# Altium project cutom_line_V1.PrjPCB
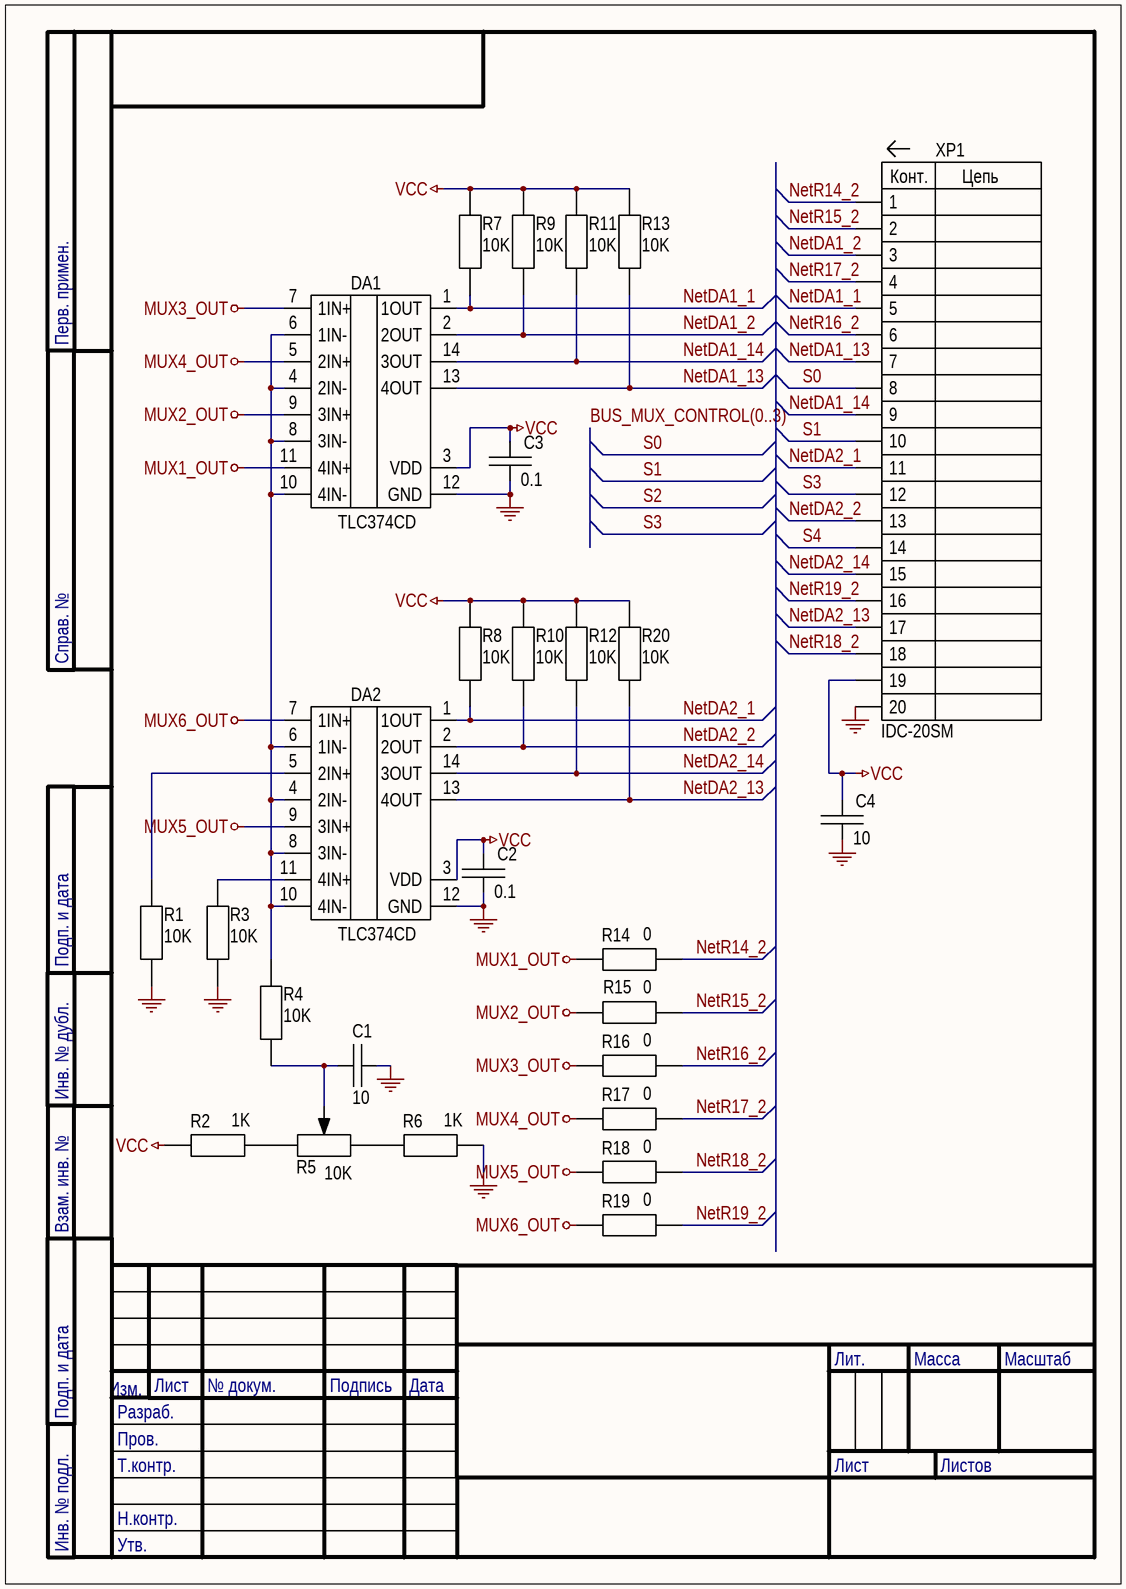
[diagram p0: custom_line_V1_comp.SchDoc]
8 sheets, 243 parts. Net scope: global (net labels, ports and power ports of the same name join across sheets).
Board file: custom_line_V1.PcbDoc
Sheets:
  custom_line_V1_comp.SchDoc
  custom_line_V1_mux1.SchDoc
  custom_line_V1_mux2.SchDoc
  custom_line_V1_mux3.SchDoc
  custom_line_V1_mux4.SchDoc
  custom_line_V1_mux5.SchDoc
  custom_line_V1_mux6.SchDoc
  Connection_To_STM32F3DYSCOVERY.SchDoc

## Sheet custom_line_V1_comp.SchDoc
size 209 x 297 mm

### Parts
C1  10  [CC_0805]
C2  0.1  [CC_0603]
C3  0.1  [CC_0603]
C4  10  [CC_0805]
DA1  type: TLC374CD  [SOIC-14]  (hidden comment: TLC374)
DA2  type: TLC374CD  [SOIC-14]  (hidden comment: TLC374)
R1  10K  [RC_0603_SMALL]
R2  1K  [RC_0603_SMALL]
R3  10K  [RC_0603_SMALL]
R4  10K  [RC_0603_SMALL]
R5  10K  [Res_3266W]
R6  1K  [RC_0603_SMALL]
R7  10K  [RC_0603_SMALL]
R8  10K  [RC_0603_SMALL]
R9  10K  [RC_0603_SMALL]
R10  10K  [RC_0603_SMALL]
R11  10K  [RC_0603_SMALL]
R12  10K  [RC_0603_SMALL]
R13  10K  [RC_0603_SMALL]
R14  0  [RC_0603_SMALL]
R15  0  [RC_0603_SMALL]
R16  0  [RC_0603_SMALL]
R17  0  [RC_0603_SMALL]
R18  0  [RC_0603_SMALL]
R19  0  [RC_0603_SMALL]
R20  10K  [RC_0603_SMALL]
XP1  IDC-20SM  [IDC-20SM]

### Nets
GND: C1.1 C2.1 C3.1 C4.1 DA1.12(GND) DA2.12(GND) R1.2 R3.2 R6.2 XP1.20
MUX1_OUT: DA1.11(4IN+) R14.1
MUX2_OUT: DA1.9(3IN+) R15.1
MUX3_OUT: DA1.7(1IN+) R16.1
MUX4_OUT: DA1.5(2IN+) R17.1
MUX5_OUT: DA2.9(3IN+) R18.1
MUX6_OUT: DA2.7(1IN+) R19.1
VCC: C2.2 C3.2 C4.2 DA1.3(VDD) DA2.3(VDD) R2.1 R7.1 R8.1 R9.1 R10.1 R11.1 R12.1 R13.1 R20.1 XP1.19
NetDA1_1: DA1.1(1OUT) R7.2 XP1.5
NetDA1_2: DA1.2(2OUT) R9.2 XP1.3
NetDA1_13: DA1.13(4OUT) R13.2 XP1.7
NetDA1_14: DA1.14(3OUT) R11.2 XP1.9
NetDA2_1: DA2.1(1OUT) R8.2 XP1.11
NetDA2_2: DA2.2(2OUT) R10.2 XP1.13
NetDA2_13: DA2.13(4OUT) R20.2 XP1.17
NetDA2_14: DA2.14(3OUT) R12.2 XP1.15
NetR14_2: R14.2 XP1.1
NetR15_2: R15.2 XP1.2
NetR16_2: R16.2 XP1.6
NetR17_2: R17.2 XP1.4
NetR18_2: R18.2 XP1.18
NetR19_2: R19.2 XP1.16
S0: XP1.8
S1: XP1.10
S3: XP1.12
S4: XP1.14
NetC1_2: C1.2 R4.2 R5.2
NetDA1_4: DA1.4(2IN-) DA1.6(1IN-) DA1.8(3IN-) DA1.10(4IN-) DA2.4(2IN-) DA2.6(1IN-) DA2.8(3IN-) DA2.10(4IN-) R4.1
NetDA2_5: DA2.5(2IN+) R1.1
NetDA2_11: DA2.11(4IN+) R3.1
NetR2_2: R2.2 R5.1
NetR5_3: R5.3 R6.1

### Buses and harness runs
bus BUS_MUX_CONTROL(0..3)

### Notes on the sheet
- Перв. примен.
- Справ. №
- Подп. и дата
- Инв. № дубл.
- Взам. инв. №
- Изм.
- Лист
- № докум.
- Подпись
- Дата
- Лит.
- Масса
- Масштаб
- Разраб.
- Пров.
- Т.контр.
- Листов
- Н.контр.
- Инв. № подл.
- Утв.
- (in symbol XT_IDC-20SM) Конт.; Цепь

### Library data of the parts
C1 C4 = C: SMD Cap 0805,106, 16V, X5R, 10% (YAGEO); type: CC0805KKX7R7BB106; value: 10uF
C2 C3 = C: SMD Cap 0603, 104, 16V, X7R, 10% (YAGEO); type: CC0603KRX7R7BB104; value: 0.1uF
DA1 DA2 = TLC374: Four Comparators (Texas Instruments)
R1 R3 R4 R7-R13 R20 = R: SMD Res 0603, 10 kOh, 1% (YAGEO); power: 0.125W; type: AC0603FR-0710KL; value: 10K
R2 R6 = R: SMD Res 0603, 1 kOh, 1% (YAGEO); power: 0.125W; type: AC0603FR-071KL; value: 1K
R5 = R_potentiometer: Trimming Potentiometer 3266W (Bourns); Tupe: 3266W-1-103LF; power: 0.25W; value: 10K
R14-R19 = R: power: 0.125W; type: RC-0603-000-5%; value: 0
XP1 = XT_IDC-20SM: Connector IDC-20SM (Connfly); type: DS1013-20SSIB1-B-0

## Sheet custom_line_V1_mux1.SchDoc
size 209 x 297 mm
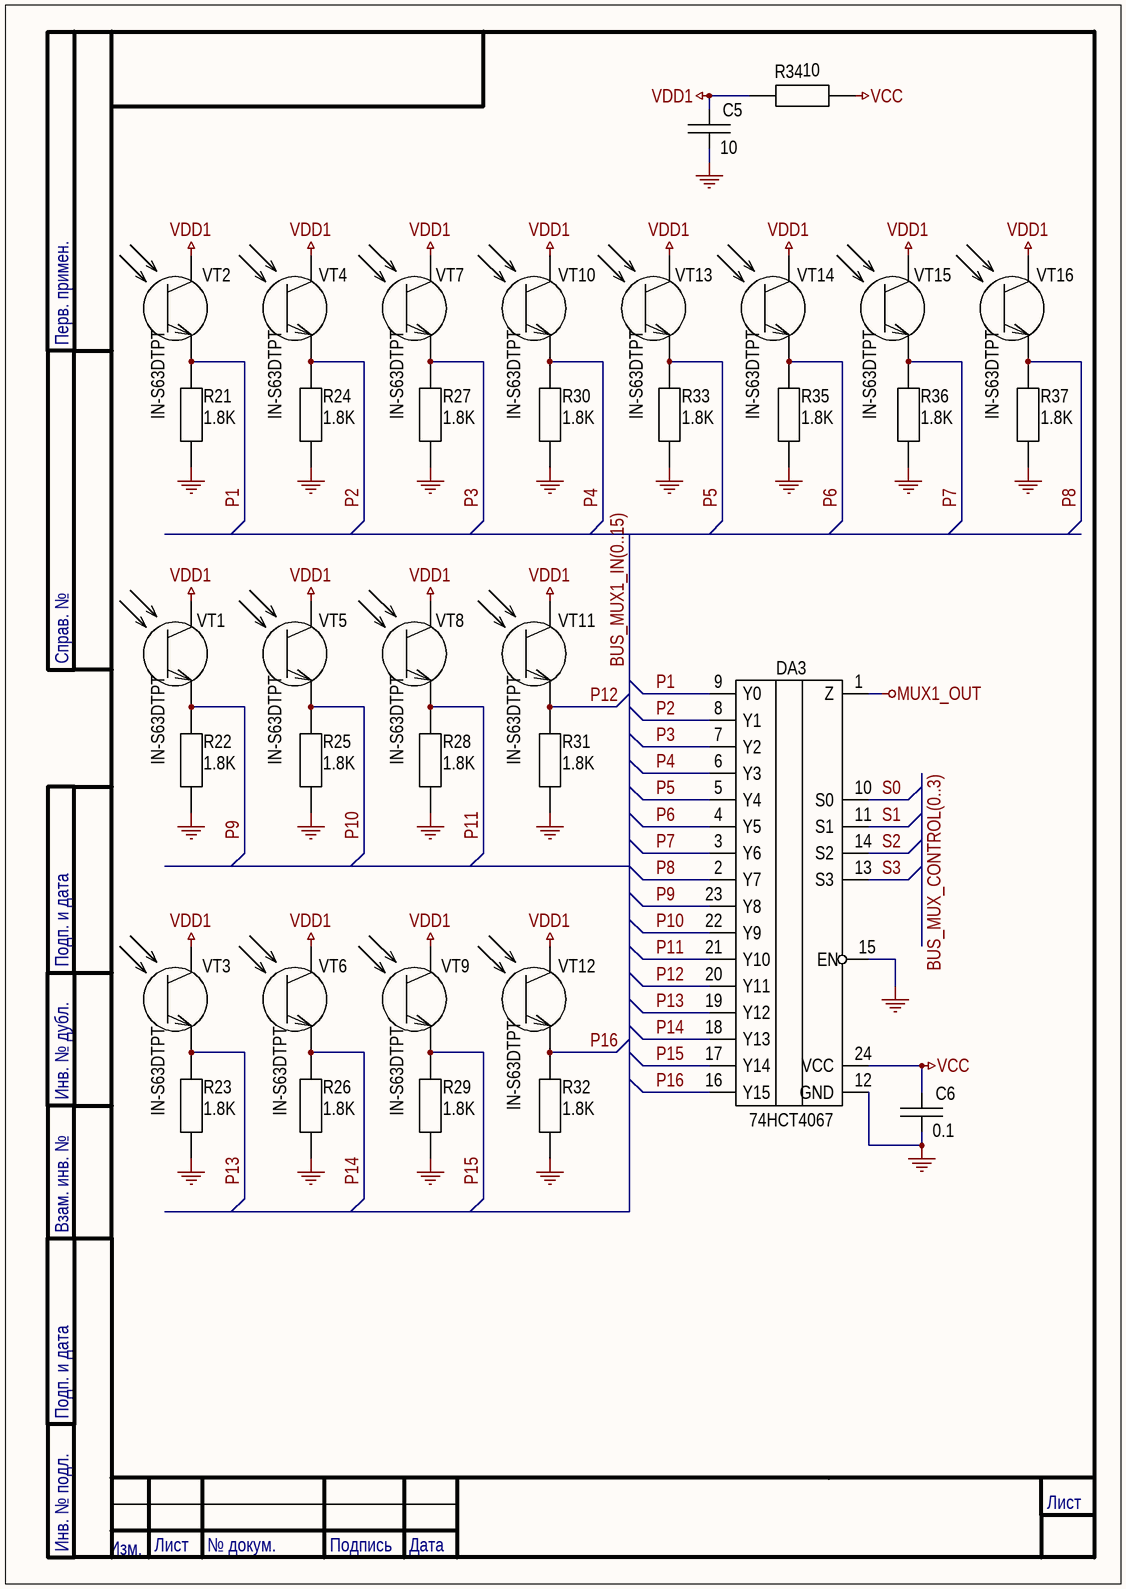
[diagram p1: custom_line_V1_mux1.SchDoc]

### Parts
C5  10  [CC_0805]
C6  0.1  [CC_0603]
DA3  74HC4067  [TSSOP-24]  (value not drawn)
R21  1.8K  [RC_0603_SMALL]
R22  1.8K  [RC_0603_SMALL]
R23  1.8K  [RC_0603_SMALL]
R24  1.8K  [RC_0603_SMALL]
R25  1.8K  [RC_0603_SMALL]
R26  1.8K  [RC_0603_SMALL]
R27  1.8K  [RC_0603_SMALL]
R28  1.8K  [RC_0603_SMALL]
R29  1.8K  [RC_0603_SMALL]
R30  1.8K  [RC_0603_SMALL]
R31  1.8K  [RC_0603_SMALL]
R32  1.8K  [RC_0603_SMALL]
R33  1.8K  [RC_0603_SMALL]
R34  10  [RC_0603_SMALL]
R35  1.8K  [RC_0603_SMALL]
R36  1.8K  [RC_0603_SMALL]
R37  1.8K  [RC_0603_SMALL]
VT1  IN-S63DTPT  [LED_0603]
VT2  IN-S63DTPT  [LED_0603]
VT3  IN-S63DTPT  [LED_0603]
VT4  IN-S63DTPT  [LED_0603]
VT5  IN-S63DTPT  [LED_0603]
VT6  IN-S63DTPT  [LED_0603]
VT7  IN-S63DTPT  [LED_0603]
VT8  IN-S63DTPT  [LED_0603]
VT9  IN-S63DTPT  [LED_0603]
VT10  IN-S63DTPT  [LED_0603]
VT11  IN-S63DTPT  [LED_0603]
VT12  IN-S63DTPT  [LED_0603]
VT13  IN-S63DTPT  [LED_0603]
VT14  IN-S63DTPT  [LED_0603]
VT15  IN-S63DTPT  [LED_0603]
VT16  IN-S63DTPT  [LED_0603]

### Nets
GND: C5.1 C6.1 DA3.12(GND) DA3.15(EN) R21.1 R22.1 R23.1 R24.1 R25.1 R26.1 R27.1 R28.1 R29.1 R30.1 R31.1 R32.1 R33.1 R35.1 R36.1 R37.1
MUX1_OUT: DA3.1(Z)
VCC: C6.2 DA3.24(VCC) R34.1
VDD1: C5.2 R34.2 VT1.1(C) VT2.1(C) VT3.1(C) VT4.1(C) VT5.1(C) VT6.1(C) VT7.1(C) VT8.1(C) VT9.1(C) VT10.1(C) VT11.1(C) VT12.1(C) VT13.1(C) VT14.1(C) VT15.1(C) VT16.1(C)
P1: DA3.9(Y0) R21.2 VT2.2(E)
P2: DA3.8(Y1) R24.2 VT4.2(E)
P3: DA3.7(Y2) R27.2 VT7.2(E)
P4: DA3.6(Y3) R30.2 VT10.2(E)
P5: DA3.5(Y4) R33.2 VT13.2(E)
P6: DA3.4(Y5) R35.2 VT14.2(E)
P7: DA3.3(Y6) R36.2 VT15.2(E)
P8: DA3.2(Y7) R37.2 VT16.2(E)
P9: DA3.23(Y8) R22.2 VT1.2(E)
P10: DA3.22(Y9) R25.2 VT5.2(E)
P11: DA3.21(Y10) R28.2 VT8.2(E)
P12: DA3.20(Y11) R31.2 VT11.2(E)
P13: DA3.19(Y12) R23.2 VT3.2(E)
P14: DA3.18(Y13) R26.2 VT6.2(E)
P15: DA3.17(Y14) R29.2 VT9.2(E)
P16: DA3.16(Y15) R32.2 VT12.2(E)
S0: DA3.10(S0)
S1: DA3.11(S1)
S2: DA3.14(S2)
S3: DA3.13(S3)

### Buses and harness runs
bus BUS_MUX1_IN(0..15)
bus BUS_MUX_CONTROL(0..3)

### Notes on the sheet
- Перв. примен.
- Справ. №
- Подп. и дата
- Инв. № дубл.
- Взам. инв. №
- Изм.
- Лист
- Инв. № подл.
- № докум.
- Подпись
- Дата

### Library data of the parts
C5 = C: type: CC-0805-106-16V-X7R-10%; value: 10uF
C6 = C: type: CC-0603-B-104-K-50; value: 0.1uF
DA3 = 74HCT4067: 74HC4067PW; type: 74HCT4067
R21-R33 R35-R37 = R: power: 0.125W; value: 100K; type: RC-0603-104-5%
R34 = R: power: 0.125W; value: R10; type: RC-0603-R10-5%
VT1-VT16 = phototransistor: Phototransistor (Inolux); type: IN-S63DTPT

## Sheet custom_line_V1_mux2.SchDoc
size 209 x 297 mm
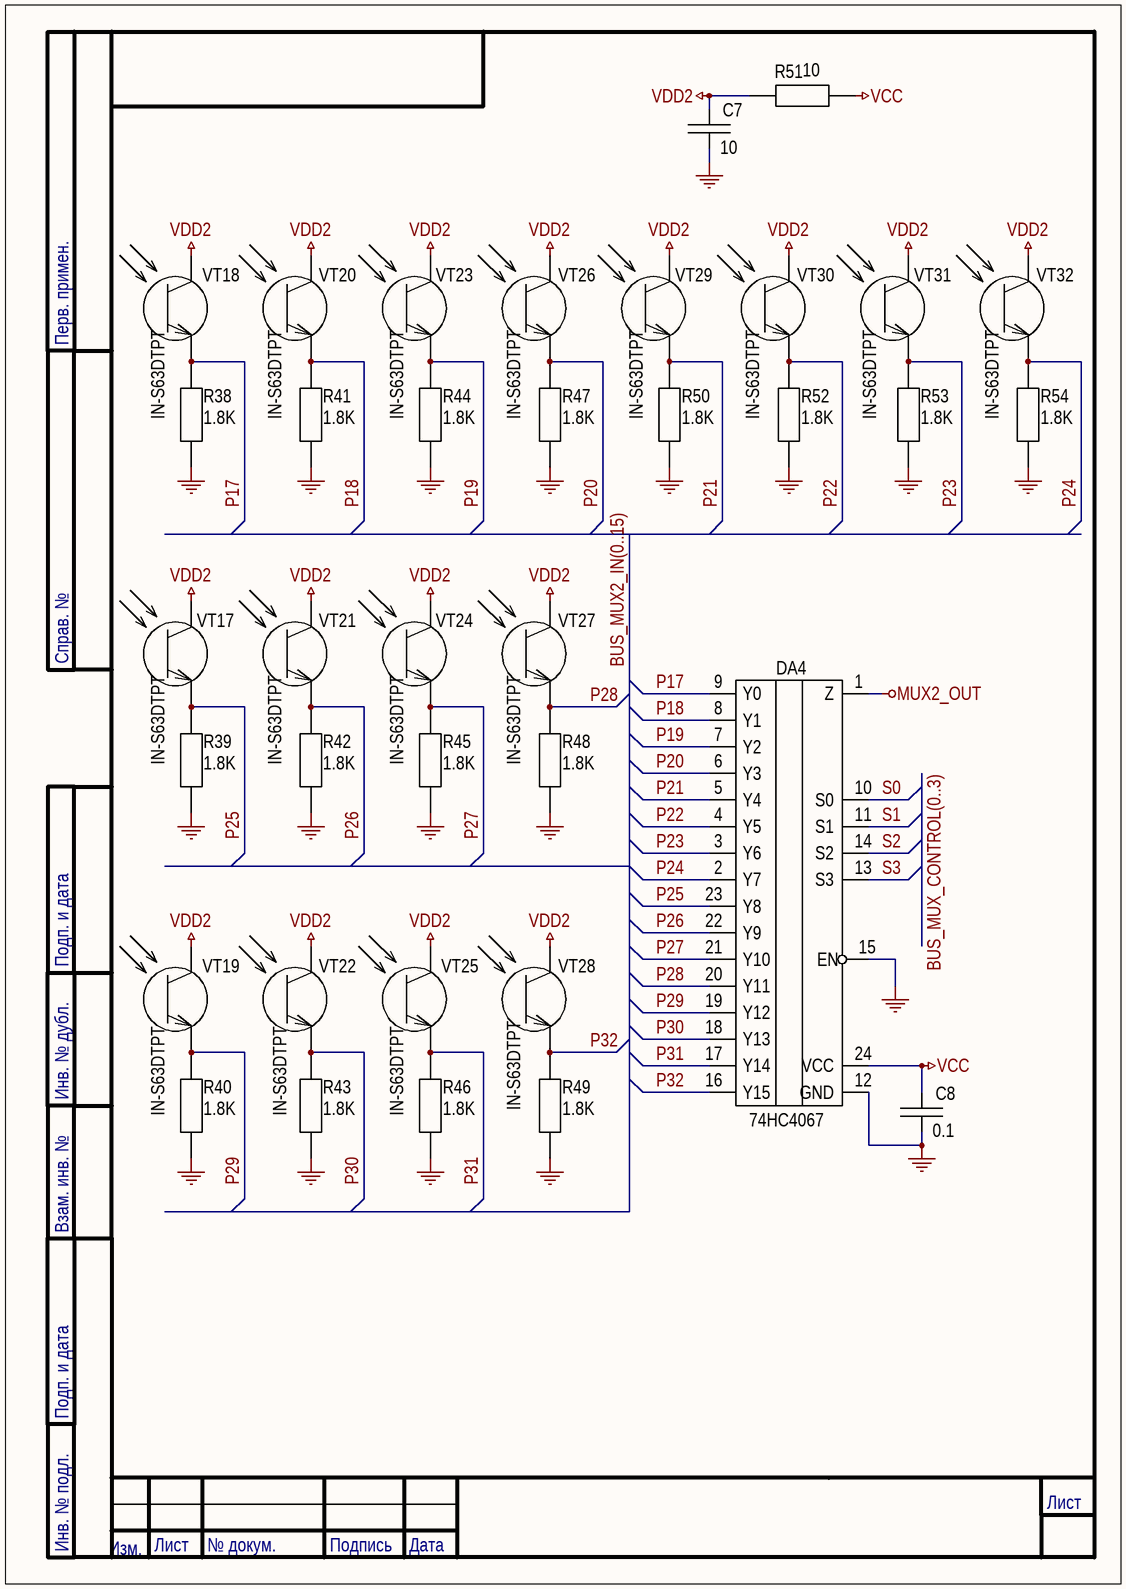
[diagram p2: custom_line_V1_mux2.SchDoc]

### Parts
C7  10  [CC_0805]
C8  0.1  [CC_0603]
DA4  74HC4067  [TSSOP-24]
R38  1.8K  [RC_0603_SMALL]
R39  1.8K  [RC_0603_SMALL]
R40  1.8K  [RC_0603_SMALL]
R41  1.8K  [RC_0603_SMALL]
R42  1.8K  [RC_0603_SMALL]
R43  1.8K  [RC_0603_SMALL]
R44  1.8K  [RC_0603_SMALL]
R45  1.8K  [RC_0603_SMALL]
R46  1.8K  [RC_0603_SMALL]
R47  1.8K  [RC_0603_SMALL]
R48  1.8K  [RC_0603_SMALL]
R49  1.8K  [RC_0603_SMALL]
R50  1.8K  [RC_0603_SMALL]
R51  10  [RC_0603_SMALL]
R52  1.8K  [RC_0603_SMALL]
R53  1.8K  [RC_0603_SMALL]
R54  1.8K  [RC_0603_SMALL]
VT17  IN-S63DTPT  [LED_0603]
VT18  IN-S63DTPT  [LED_0603]
VT19  IN-S63DTPT  [LED_0603]
VT20  IN-S63DTPT  [LED_0603]
VT21  IN-S63DTPT  [LED_0603]
VT22  IN-S63DTPT  [LED_0603]
VT23  IN-S63DTPT  [LED_0603]
VT24  IN-S63DTPT  [LED_0603]
VT25  IN-S63DTPT  [LED_0603]
VT26  IN-S63DTPT  [LED_0603]
VT27  IN-S63DTPT  [LED_0603]
VT28  IN-S63DTPT  [LED_0603]
VT29  IN-S63DTPT  [LED_0603]
VT30  IN-S63DTPT  [LED_0603]
VT31  IN-S63DTPT  [LED_0603]
VT32  IN-S63DTPT  [LED_0603]

### Nets
GND: C7.1 C8.1 DA4.12(GND) DA4.15(EN) R38.1 R39.1 R40.1 R41.1 R42.1 R43.1 R44.1 R45.1 R46.1 R47.1 R48.1 R49.1 R50.1 R52.1 R53.1 R54.1
MUX2_OUT: DA4.1(Z)
VCC: C8.2 DA4.24(VCC) R51.1
VDD2: C7.2 R51.2 VT17.1(C) VT18.1(C) VT19.1(C) VT20.1(C) VT21.1(C) VT22.1(C) VT23.1(C) VT24.1(C) VT25.1(C) VT26.1(C) VT27.1(C) VT28.1(C) VT29.1(C) VT30.1(C) VT31.1(C) VT32.1(C)
P17: DA4.9(Y0) R38.2 VT18.2(E)
P18: DA4.8(Y1) R41.2 VT20.2(E)
P19: DA4.7(Y2) R44.2 VT23.2(E)
P20: DA4.6(Y3) R47.2 VT26.2(E)
P21: DA4.5(Y4) R50.2 VT29.2(E)
P22: DA4.4(Y5) R52.2 VT30.2(E)
P23: DA4.3(Y6) R53.2 VT31.2(E)
P24: DA4.2(Y7) R54.2 VT32.2(E)
P25: DA4.23(Y8) R39.2 VT17.2(E)
P26: DA4.22(Y9) R42.2 VT21.2(E)
P27: DA4.21(Y10) R45.2 VT24.2(E)
P28: DA4.20(Y11) R48.2 VT27.2(E)
P29: DA4.19(Y12) R40.2 VT19.2(E)
P30: DA4.18(Y13) R43.2 VT22.2(E)
P31: DA4.17(Y14) R46.2 VT25.2(E)
P32: DA4.16(Y15) R49.2 VT28.2(E)
S0: DA4.10(S0)
S1: DA4.11(S1)
S2: DA4.14(S2)
S3: DA4.13(S3)

### Buses and harness runs
bus BUS_MUX2_IN(0..15)
bus BUS_MUX_CONTROL(0..3)

### Notes on the sheet
- Перв. примен.
- Справ. №
- Подп. и дата
- Инв. № дубл.
- Взам. инв. №
- Изм.
- Лист
- Инв. № подл.
- № докум.
- Подпись
- Дата

### Library data of the parts
C7 = C: as C5 on sheet custom_line_V1_mux1
C8 = C: type: CC-0603-B-104-K-50; value: 0.1uF
DA4 = 74HCT4067: 74HC4067PW; type: 74HC4067
R38-R50 R52-R54 = R: power: 0.125W; value: 100K; type: RC-0603-104-5%
R51 = R: power: 0.125W; type: RC-0603-R10-5%; value: 10
VT17-VT32 = phototransistor: Phototransistor (Inolux); type: IN-S63DTPT

## Sheet custom_line_V1_mux3.SchDoc
size 209 x 297 mm
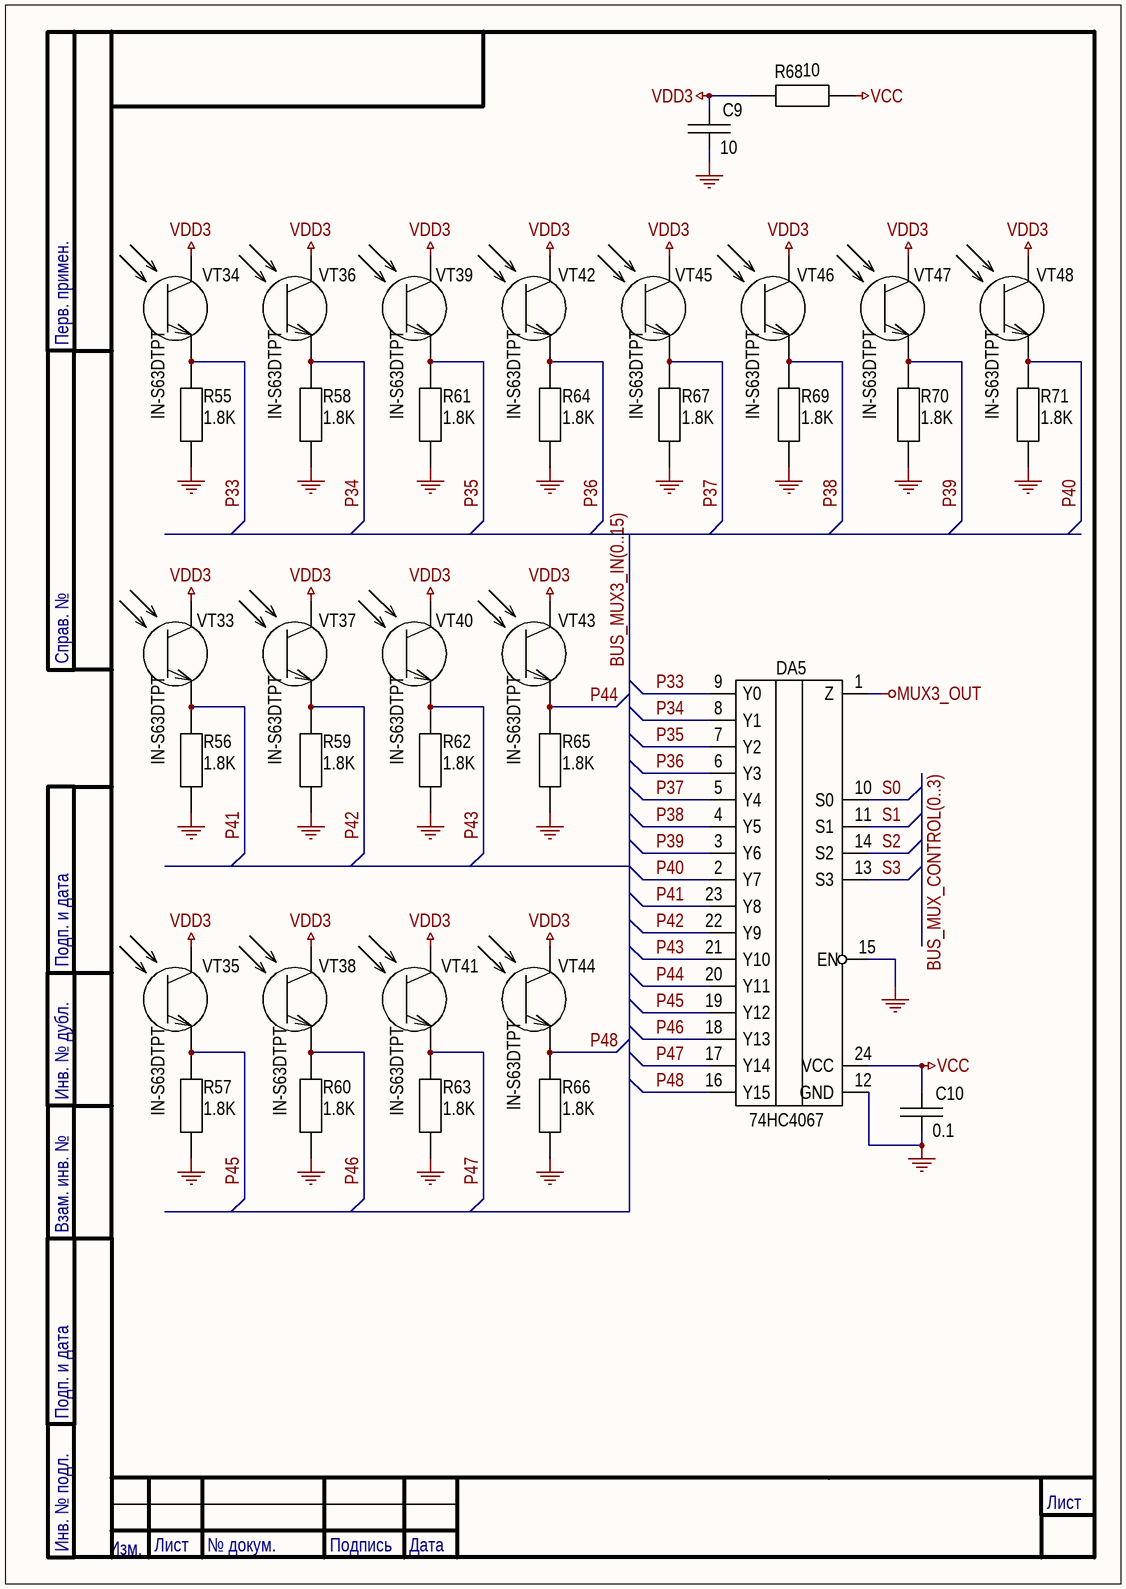
[diagram p3: custom_line_V1_mux3.SchDoc]

### Parts
C9  10  [CC_0805]
C10  0.1  [CC_0603]
DA5  74HC4067  [TSSOP-24]
R55  1.8K  [RC_0603_SMALL]
R56  1.8K  [RC_0603_SMALL]
R57  1.8K  [RC_0603_SMALL]
R58  1.8K  [RC_0603_SMALL]
R59  1.8K  [RC_0603_SMALL]
R60  1.8K  [RC_0603_SMALL]
R61  1.8K  [RC_0603_SMALL]
R62  1.8K  [RC_0603_SMALL]
R63  1.8K  [RC_0603_SMALL]
R64  1.8K  [RC_0603_SMALL]
R65  1.8K  [RC_0603_SMALL]
R66  1.8K  [RC_0603_SMALL]
R67  1.8K  [RC_0603_SMALL]
R68  10  [RC_0603_SMALL]
R69  1.8K  [RC_0603_SMALL]
R70  1.8K  [RC_0603_SMALL]
R71  1.8K  [RC_0603_SMALL]
VT33  IN-S63DTPT  [LED_0603]
VT34  IN-S63DTPT  [LED_0603]
VT35  IN-S63DTPT  [LED_0603]
VT36  IN-S63DTPT  [LED_0603]
VT37  IN-S63DTPT  [LED_0603]
VT38  IN-S63DTPT  [LED_0603]
VT39  IN-S63DTPT  [LED_0603]
VT40  IN-S63DTPT  [LED_0603]
VT41  IN-S63DTPT  [LED_0603]
VT42  IN-S63DTPT  [LED_0603]
VT43  IN-S63DTPT  [LED_0603]
VT44  IN-S63DTPT  [LED_0603]
VT45  IN-S63DTPT  [LED_0603]
VT46  IN-S63DTPT  [LED_0603]
VT47  IN-S63DTPT  [LED_0603]
VT48  IN-S63DTPT  [LED_0603]

### Nets
GND: C9.1 C10.1 DA5.12(GND) DA5.15(EN) R55.1 R56.1 R57.1 R58.1 R59.1 R60.1 R61.1 R62.1 R63.1 R64.1 R65.1 R66.1 R67.1 R69.1 R70.1 R71.1
MUX3_OUT: DA5.1(Z)
VCC: C10.2 DA5.24(VCC) R68.1
VDD3: C9.2 R68.2 VT33.1(C) VT34.1(C) VT35.1(C) VT36.1(C) VT37.1(C) VT38.1(C) VT39.1(C) VT40.1(C) VT41.1(C) VT42.1(C) VT43.1(C) VT44.1(C) VT45.1(C) VT46.1(C) VT47.1(C) VT48.1(C)
P33: DA5.9(Y0) R55.2 VT34.2(E)
P34: DA5.8(Y1) R58.2 VT36.2(E)
P35: DA5.7(Y2) R61.2 VT39.2(E)
P36: DA5.6(Y3) R64.2 VT42.2(E)
P37: DA5.5(Y4) R67.2 VT45.2(E)
P38: DA5.4(Y5) R69.2 VT46.2(E)
P39: DA5.3(Y6) R70.2 VT47.2(E)
P40: DA5.2(Y7) R71.2 VT48.2(E)
P41: DA5.23(Y8) R56.2 VT33.2(E)
P42: DA5.22(Y9) R59.2 VT37.2(E)
P43: DA5.21(Y10) R62.2 VT40.2(E)
P44: DA5.20(Y11) R65.2 VT43.2(E)
P45: DA5.19(Y12) R57.2 VT35.2(E)
P46: DA5.18(Y13) R60.2 VT38.2(E)
P47: DA5.17(Y14) R63.2 VT41.2(E)
P48: DA5.16(Y15) R66.2 VT44.2(E)
S0: DA5.10(S0)
S1: DA5.11(S1)
S2: DA5.14(S2)
S3: DA5.13(S3)

### Buses and harness runs
bus BUS_MUX3_IN(0..15)
bus BUS_MUX_CONTROL(0..3)

### Notes on the sheet
- Перв. примен.
- Справ. №
- Подп. и дата
- Инв. № дубл.
- Взам. инв. №
- Изм.
- Лист
- Инв. № подл.
- № докум.
- Подпись
- Дата

### Library data of the parts
C9 = C: as C5 on sheet custom_line_V1_mux1
C10 = C: type: CC-0603-B-104-K-50; value: 0.1uF
DA5 = 74HCT4067: 74HC4067PW; type: 74HC4067
R55-R67 R69-R71 = R: power: 0.125W; value: 100K; type: RC-0603-104-5%
R68 = R: power: 0.125W; type: RC-0603-R10-5%; value: 10
VT33-VT48 = phototransistor: Phototransistor (Inolux); type: IN-S63DTPT

## Sheet custom_line_V1_mux4.SchDoc
size 209 x 297 mm
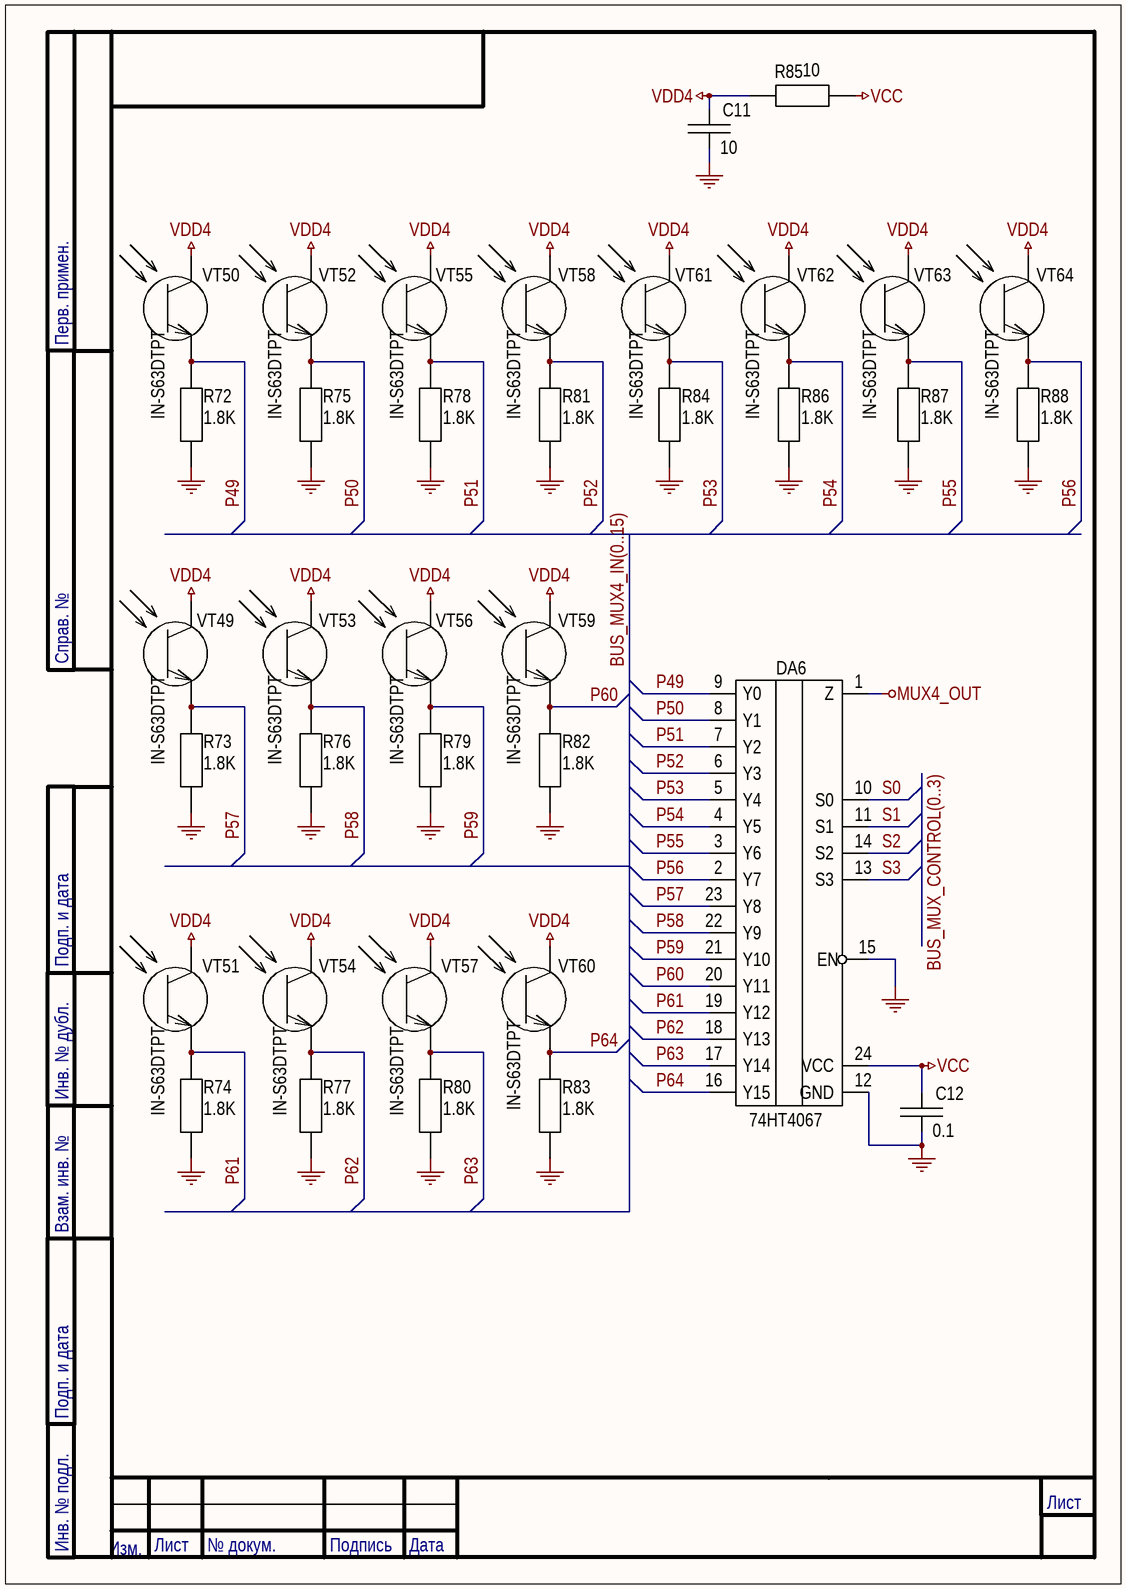
[diagram p4: custom_line_V1_mux4.SchDoc]

### Parts
C11  10  [CC_0805]
C12  0.1  [CC_0603]
DA6  type: 74HT4067  [TSSOP-24]  (hidden comment: 74HC4067)
R72  1.8K  [RC_0603_SMALL]
R73  1.8K  [RC_0603_SMALL]
R74  1.8K  [RC_0603_SMALL]
R75  1.8K  [RC_0603_SMALL]
R76  1.8K  [RC_0603_SMALL]
R77  1.8K  [RC_0603_SMALL]
R78  1.8K  [RC_0603_SMALL]
R79  1.8K  [RC_0603_SMALL]
R80  1.8K  [RC_0603_SMALL]
R81  1.8K  [RC_0603_SMALL]
R82  1.8K  [RC_0603_SMALL]
R83  1.8K  [RC_0603_SMALL]
R84  1.8K  [RC_0603_SMALL]
R85  10  [RC_0603_SMALL]
R86  1.8K  [RC_0603_SMALL]
R87  1.8K  [RC_0603_SMALL]
R88  1.8K  [RC_0603_SMALL]
VT49  IN-S63DTPT  [LED_0603]
VT50  IN-S63DTPT  [LED_0603]
VT51  IN-S63DTPT  [LED_0603]
VT52  IN-S63DTPT  [LED_0603]
VT53  IN-S63DTPT  [LED_0603]
VT54  IN-S63DTPT  [LED_0603]
VT55  IN-S63DTPT  [LED_0603]
VT56  IN-S63DTPT  [LED_0603]
VT57  IN-S63DTPT  [LED_0603]
VT58  IN-S63DTPT  [LED_0603]
VT59  IN-S63DTPT  [LED_0603]
VT60  IN-S63DTPT  [LED_0603]
VT61  IN-S63DTPT  [LED_0603]
VT62  IN-S63DTPT  [LED_0603]
VT63  IN-S63DTPT  [LED_0603]
VT64  IN-S63DTPT  [LED_0603]

### Nets
GND: C11.1 C12.1 DA6.12(GND) DA6.15(EN) R72.1 R73.1 R74.1 R75.1 R76.1 R77.1 R78.1 R79.1 R80.1 R81.1 R82.1 R83.1 R84.1 R86.1 R87.1 R88.1
MUX4_OUT: DA6.1(Z)
VCC: C12.2 DA6.24(VCC) R85.1
VDD4: C11.2 R85.2 VT49.1(C) VT50.1(C) VT51.1(C) VT52.1(C) VT53.1(C) VT54.1(C) VT55.1(C) VT56.1(C) VT57.1(C) VT58.1(C) VT59.1(C) VT60.1(C) VT61.1(C) VT62.1(C) VT63.1(C) VT64.1(C)
P49: DA6.9(Y0) R72.2 VT50.2(E)
P50: DA6.8(Y1) R75.2 VT52.2(E)
P51: DA6.7(Y2) R78.2 VT55.2(E)
P52: DA6.6(Y3) R81.2 VT58.2(E)
P53: DA6.5(Y4) R84.2 VT61.2(E)
P54: DA6.4(Y5) R86.2 VT62.2(E)
P55: DA6.3(Y6) R87.2 VT63.2(E)
P56: DA6.2(Y7) R88.2 VT64.2(E)
P57: DA6.23(Y8) R73.2 VT49.2(E)
P58: DA6.22(Y9) R76.2 VT53.2(E)
P59: DA6.21(Y10) R79.2 VT56.2(E)
P60: DA6.20(Y11) R82.2 VT59.2(E)
P61: DA6.19(Y12) R74.2 VT51.2(E)
P62: DA6.18(Y13) R77.2 VT54.2(E)
P63: DA6.17(Y14) R80.2 VT57.2(E)
P64: DA6.16(Y15) R83.2 VT60.2(E)
S0: DA6.10(S0)
S1: DA6.11(S1)
S2: DA6.14(S2)
S3: DA6.13(S3)

### Buses and harness runs
bus BUS_MUX4_IN(0..15)
bus BUS_MUX_CONTROL(0..3)

### Notes on the sheet
- Перв. примен.
- Справ. №
- Подп. и дата
- Инв. № дубл.
- Взам. инв. №
- Изм.
- Лист
- Инв. № подл.
- № докум.
- Подпись
- Дата

### Library data of the parts
C11 = C: as C5 on sheet custom_line_V1_mux1
C12 = C: type: CC-0603-B-104-K-50; value: 0.1uF
DA6 = 74HCT4067: 74HC4067PW
R72-R84 R86-R88 = R: power: 0.125W; value: 100K; type: RC-0603-104-5%
R85 = R: power: 0.125W; type: RC-0603-R10-5%; value: 10
VT49-VT64 = phototransistor: Phototransistor (Inolux); type: IN-S63DTPT

## Sheet custom_line_V1_mux5.SchDoc
size 209 x 297 mm
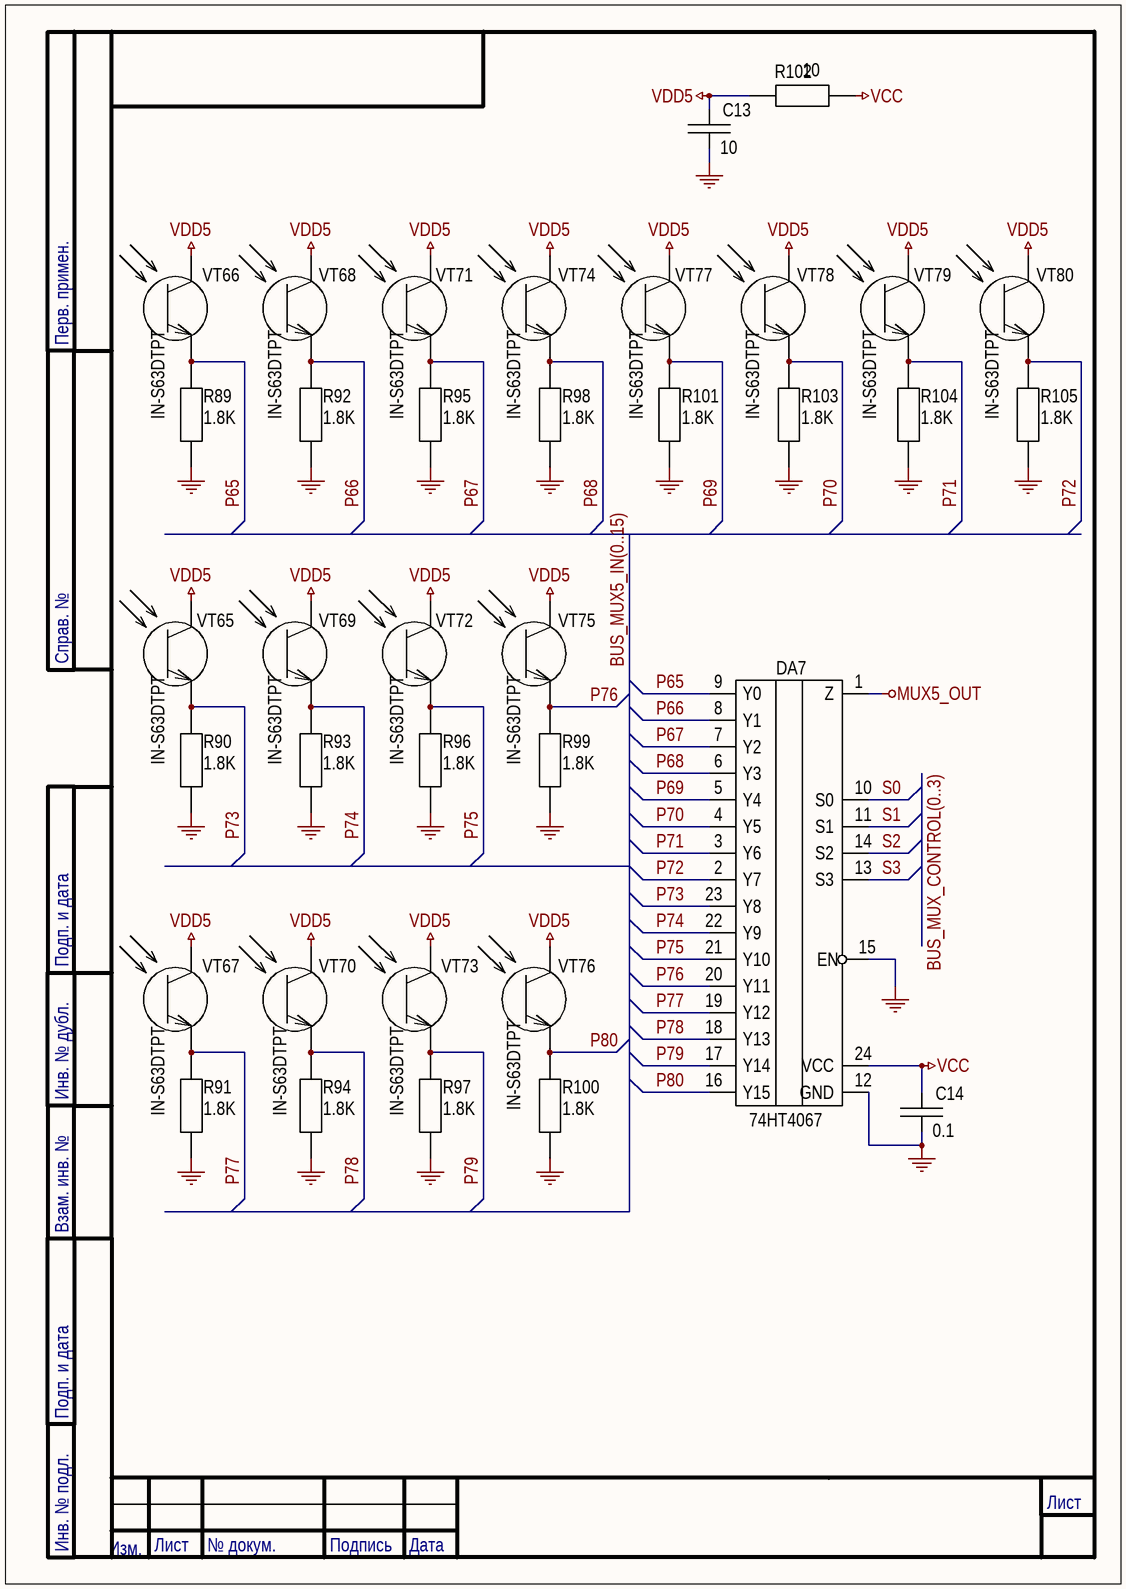
[diagram p5: custom_line_V1_mux5.SchDoc]

### Parts
C13  10  [CC_0805]
C14  0.1  [CC_0603]
DA7  type: 74HT4067  [TSSOP-24]  (hidden comment: 74HC4067)
R89  1.8K  [RC_0603_SMALL]
R90  1.8K  [RC_0603_SMALL]
R91  1.8K  [RC_0603_SMALL]
R92  1.8K  [RC_0603_SMALL]
R93  1.8K  [RC_0603_SMALL]
R94  1.8K  [RC_0603_SMALL]
R95  1.8K  [RC_0603_SMALL]
R96  1.8K  [RC_0603_SMALL]
R97  1.8K  [RC_0603_SMALL]
R98  1.8K  [RC_0603_SMALL]
R99  1.8K  [RC_0603_SMALL]
R100  1.8K  [RC_0603_SMALL]
R101  1.8K  [RC_0603_SMALL]
R102  10  [RC_0603_SMALL]
R103  1.8K  [RC_0603_SMALL]
R104  1.8K  [RC_0603_SMALL]
R105  1.8K  [RC_0603_SMALL]
VT65  IN-S63DTPT  [LED_0603]
VT66  IN-S63DTPT  [LED_0603]
VT67  IN-S63DTPT  [LED_0603]
VT68  IN-S63DTPT  [LED_0603]
VT69  IN-S63DTPT  [LED_0603]
VT70  IN-S63DTPT  [LED_0603]
VT71  IN-S63DTPT  [LED_0603]
VT72  IN-S63DTPT  [LED_0603]
VT73  IN-S63DTPT  [LED_0603]
VT74  IN-S63DTPT  [LED_0603]
VT75  IN-S63DTPT  [LED_0603]
VT76  IN-S63DTPT  [LED_0603]
VT77  IN-S63DTPT  [LED_0603]
VT78  IN-S63DTPT  [LED_0603]
VT79  IN-S63DTPT  [LED_0603]
VT80  IN-S63DTPT  [LED_0603]

### Nets
GND: C13.1 C14.1 DA7.12(GND) DA7.15(EN) R89.1 R90.1 R91.1 R92.1 R93.1 R94.1 R95.1 R96.1 R97.1 R98.1 R99.1 R100.1 R101.1 R103.1 R104.1 R105.1
MUX5_OUT: DA7.1(Z)
VCC: C14.2 DA7.24(VCC) R102.1
VDD5: C13.2 R102.2 VT65.1(C) VT66.1(C) VT67.1(C) VT68.1(C) VT69.1(C) VT70.1(C) VT71.1(C) VT72.1(C) VT73.1(C) VT74.1(C) VT75.1(C) VT76.1(C) VT77.1(C) VT78.1(C) VT79.1(C) VT80.1(C)
P65: DA7.9(Y0) R89.2 VT66.2(E)
P66: DA7.8(Y1) R92.2 VT68.2(E)
P67: DA7.7(Y2) R95.2 VT71.2(E)
P68: DA7.6(Y3) R98.2 VT74.2(E)
P69: DA7.5(Y4) R101.2 VT77.2(E)
P70: DA7.4(Y5) R103.2 VT78.2(E)
P71: DA7.3(Y6) R104.2 VT79.2(E)
P72: DA7.2(Y7) R105.2 VT80.2(E)
P73: DA7.23(Y8) R90.2 VT65.2(E)
P74: DA7.22(Y9) R93.2 VT69.2(E)
P75: DA7.21(Y10) R96.2 VT72.2(E)
P76: DA7.20(Y11) R99.2 VT75.2(E)
P77: DA7.19(Y12) R91.2 VT67.2(E)
P78: DA7.18(Y13) R94.2 VT70.2(E)
P79: DA7.17(Y14) R97.2 VT73.2(E)
P80: DA7.16(Y15) R100.2 VT76.2(E)
S0: DA7.10(S0)
S1: DA7.11(S1)
S2: DA7.14(S2)
S3: DA7.13(S3)

### Buses and harness runs
bus BUS_MUX5_IN(0..15)
bus BUS_MUX_CONTROL(0..3)

### Notes on the sheet
- Перв. примен.
- Справ. №
- Подп. и дата
- Инв. № дубл.
- Взам. инв. №
- Изм.
- Лист
- Инв. № подл.
- № докум.
- Подпись
- Дата

### Library data of the parts
C13 = C: as C5 on sheet custom_line_V1_mux1
C14 = C: type: CC-0603-B-104-K-50; value: 0.1uF
DA7 = 74HCT4067: 74HC4067PW
R89-R101 R103-R105 = R: power: 0.125W; value: 100K; type: RC-0603-104-5%
R102 = R: power: 0.125W; type: RC-0603-R10-5%; value: 10
VT65-VT80 = phototransistor: Phototransistor (Inolux); type: IN-S63DTPT

## Sheet custom_line_V1_mux6.SchDoc
size 209 x 297 mm
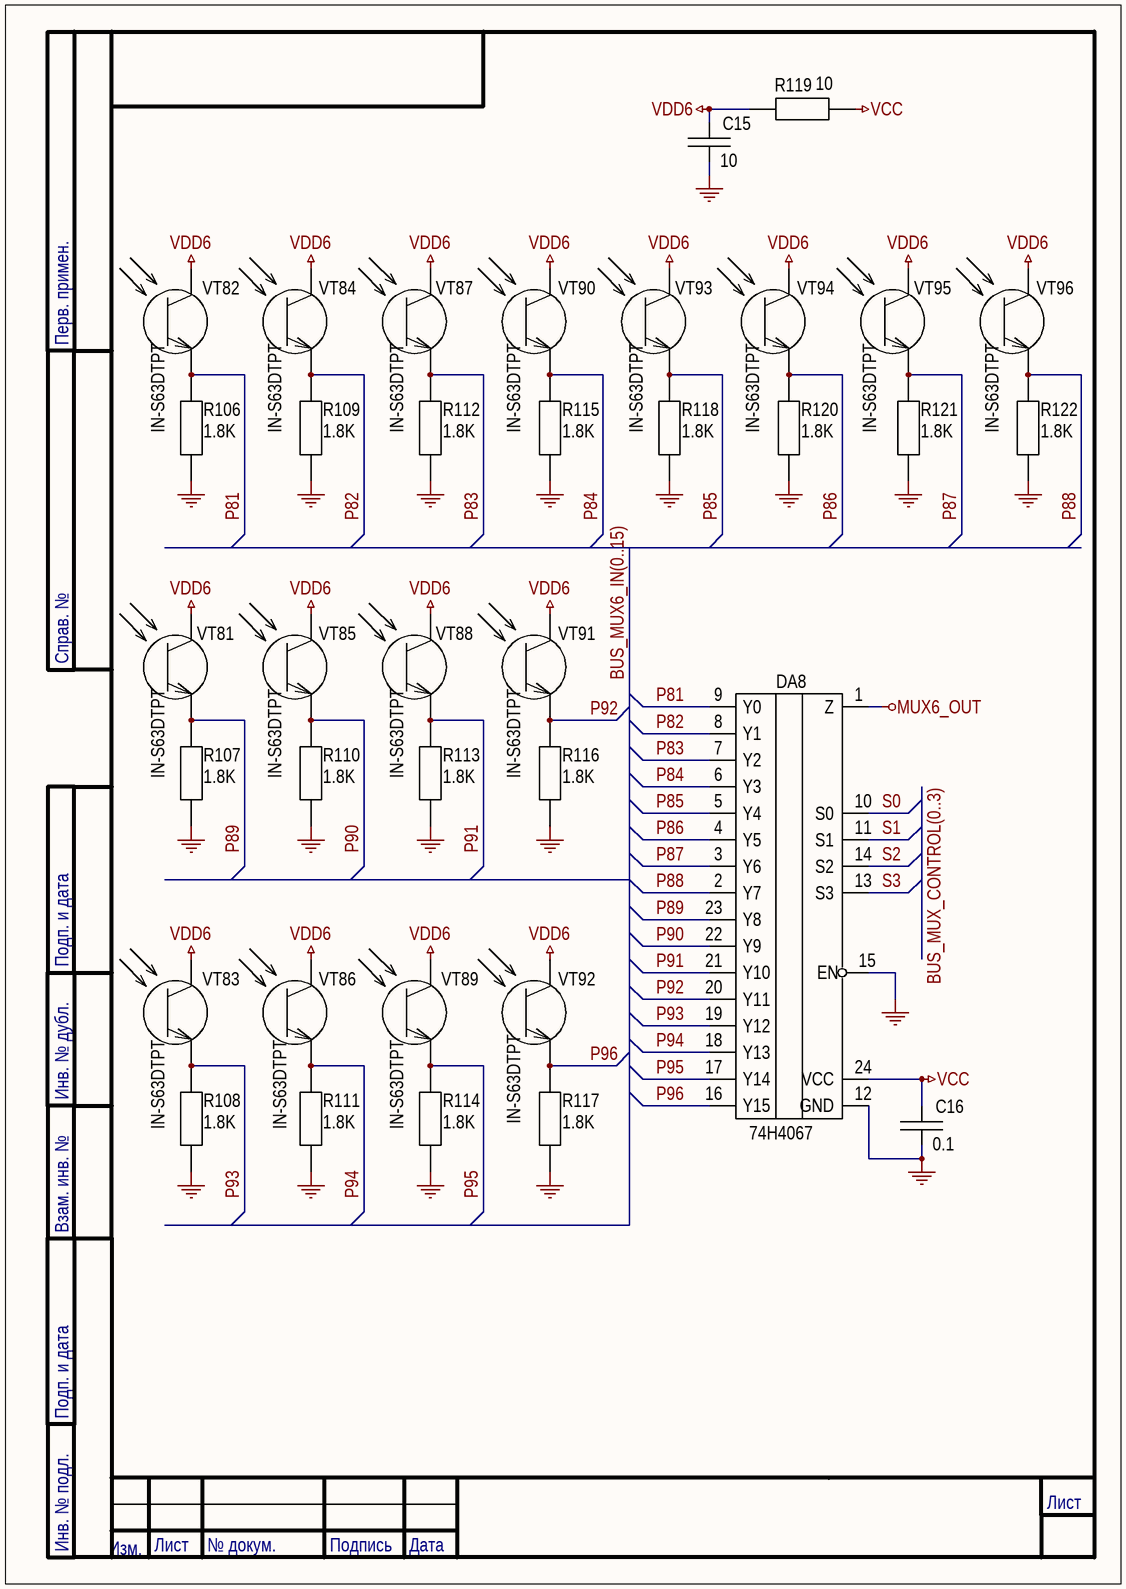
[diagram p6: custom_line_V1_mux6.SchDoc]

### Parts
C15  10  [CC_0805]
C16  0.1  [CC_0603]
DA8  type: 74H4067  [TSSOP-24]  (hidden comment: 74HC4067)
R106  1.8K  [RC_0603_SMALL]
R107  1.8K  [RC_0603_SMALL]
R108  1.8K  [RC_0603_SMALL]
R109  1.8K  [RC_0603_SMALL]
R110  1.8K  [RC_0603_SMALL]
R111  1.8K  [RC_0603_SMALL]
R112  1.8K  [RC_0603_SMALL]
R113  1.8K  [RC_0603_SMALL]
R114  1.8K  [RC_0603_SMALL]
R115  1.8K  [RC_0603_SMALL]
R116  1.8K  [RC_0603_SMALL]
R117  1.8K  [RC_0603_SMALL]
R118  1.8K  [RC_0603_SMALL]
R119  10  [RC_0603_SMALL]
R120  1.8K  [RC_0603_SMALL]
R121  1.8K  [RC_0603_SMALL]
R122  1.8K  [RC_0603_SMALL]
VT81  IN-S63DTPT  [LED_0603]
VT82  IN-S63DTPT  [LED_0603]
VT83  IN-S63DTPT  [LED_0603]
VT84  IN-S63DTPT  [LED_0603]
VT85  IN-S63DTPT  [LED_0603]
VT86  IN-S63DTPT  [LED_0603]
VT87  IN-S63DTPT  [LED_0603]
VT88  IN-S63DTPT  [LED_0603]
VT89  IN-S63DTPT  [LED_0603]
VT90  IN-S63DTPT  [LED_0603]
VT91  IN-S63DTPT  [LED_0603]
VT92  IN-S63DTPT  [LED_0603]
VT93  IN-S63DTPT  [LED_0603]
VT94  IN-S63DTPT  [LED_0603]
VT95  IN-S63DTPT  [LED_0603]
VT96  IN-S63DTPT  [LED_0603]

### Nets
GND: C15.1 C16.1 DA8.12(GND) DA8.15(EN) R106.1 R107.1 R108.1 R109.1 R110.1 R111.1 R112.1 R113.1 R114.1 R115.1 R116.1 R117.1 R118.1 R120.1 R121.1 R122.1
MUX6_OUT: DA8.1(Z)
VCC: C16.2 DA8.24(VCC) R119.1
VDD6: C15.2 R119.2 VT81.1(C) VT82.1(C) VT83.1(C) VT84.1(C) VT85.1(C) VT86.1(C) VT87.1(C) VT88.1(C) VT89.1(C) VT90.1(C) VT91.1(C) VT92.1(C) VT93.1(C) VT94.1(C) VT95.1(C) VT96.1(C)
P81: DA8.9(Y0) R106.2 VT82.2(E)
P82: DA8.8(Y1) R109.2 VT84.2(E)
P83: DA8.7(Y2) R112.2 VT87.2(E)
P84: DA8.6(Y3) R115.2 VT90.2(E)
P85: DA8.5(Y4) R118.2 VT93.2(E)
P86: DA8.4(Y5) R120.2 VT94.2(E)
P87: DA8.3(Y6) R121.2 VT95.2(E)
P88: DA8.2(Y7) R122.2 VT96.2(E)
P89: DA8.23(Y8) R107.2 VT81.2(E)
P90: DA8.22(Y9) R110.2 VT85.2(E)
P91: DA8.21(Y10) R113.2 VT88.2(E)
P92: DA8.20(Y11) R116.2 VT91.2(E)
P93: DA8.19(Y12) R108.2 VT83.2(E)
P94: DA8.18(Y13) R111.2 VT86.2(E)
P95: DA8.17(Y14) R114.2 VT89.2(E)
P96: DA8.16(Y15) R117.2 VT92.2(E)
S0: DA8.10(S0)
S1: DA8.11(S1)
S2: DA8.14(S2)
S3: DA8.13(S3)

### Buses and harness runs
bus BUS_MUX6_IN(0..15)
bus BUS_MUX_CONTROL(0..3)

### Notes on the sheet
- Перв. примен.
- Справ. №
- Подп. и дата
- Инв. № дубл.
- Взам. инв. №
- Изм.
- Лист
- Инв. № подл.
- № докум.
- Подпись
- Дата

### Library data of the parts
C15 = C: as C5 on sheet custom_line_V1_mux1
C16 = C: type: CC-0603-B-104-K-50; value: 0.1uF
DA8 = 74HCT4067: 74HC4067PW
R106-R118 R120-R122 = R: power: 0.125W; value: 100K; type: RC-0603-104-5%
R119 = R: power: 0.125W; type: RC-0603-R10-5%; value: 10
VT81-VT96 = phototransistor: Phototransistor (Inolux); type: IN-S63DTPT

## Sheet Connection_To_STM32F3DYSCOVERY.SchDoc
size 209 x 297 mm
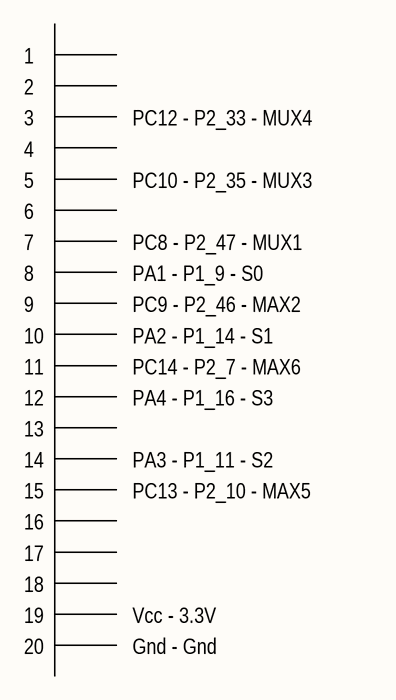
[diagram p7: Connection_To_STM32F3DYSCOVERY.SchDoc]

### Notes on the sheet
- 1
- 2
- 3
- PC12 - P2_33 - MUX4
- 4
- 5
- PC10 - P2_35 - MUX3
- 6
- 7
- 8
- PC8 - P2_47 - MUX1
- PA1 - P1_9 - S0
- 9
- 10
- PC9 - P2_46 - MAX2
- PA2 - P1_14 - S1
- 11
- 12
- 13
- PC14 - P2_7 - MAX6
- PA4 - P1_16 - S3
- 14
- 15
- PC13 - P2_10 - MAX5
- PA3 - P1_11 - S2
- 16
- 17
- 18
- 19
- 20
- Vcc - 3.3V
- Gnd - Gnd
- Перв. примен.
- Справ. №
- Подп. и дата
- Инв. № дубл.
- Взам. инв. №
- Изм.
- Лист
- № докум.
- Подпись
- Дата
- Лит.
- Масса
- Масштаб
- Разраб.
- Пров.
- Т.контр.
- Листов
- Н.контр.
- Инв. № подл.
- Утв.

## Nets that join several sheets
GND: custom_line_V1_comp (10 pins), custom_line_V1_mux1 (20 pins), custom_line_V1_mux2 (20 pins), custom_line_V1_mux3 (20 pins), custom_line_V1_mux4 (20 pins), custom_line_V1_mux5 (20 pins), custom_line_V1_mux6 (20 pins)
MUX1_OUT: custom_line_V1_comp (DA1.11 R14.1), custom_line_V1_mux1 (DA3.1)
MUX2_OUT: custom_line_V1_comp (DA1.9 R15.1), custom_line_V1_mux2 (DA4.1)
MUX3_OUT: custom_line_V1_comp (DA1.7 R16.1), custom_line_V1_mux3 (DA5.1)
MUX4_OUT: custom_line_V1_comp (DA1.5 R17.1), custom_line_V1_mux4 (DA6.1)
MUX5_OUT: custom_line_V1_comp (DA2.9 R18.1), custom_line_V1_mux5 (DA7.1)
MUX6_OUT: custom_line_V1_comp (DA2.7 R19.1), custom_line_V1_mux6 (DA8.1)
VCC: custom_line_V1_comp (15 pins), custom_line_V1_mux1 (C6.2 DA3.24 R34.1), custom_line_V1_mux2 (C8.2 DA4.24 R51.1), custom_line_V1_mux3 (C10.2 DA5.24 R68.1), custom_line_V1_mux4 (C12.2 DA6.24 R85.1), custom_line_V1_mux5 (C14.2 DA7.24 R102.1), custom_line_V1_mux6 (C16.2 DA8.24 R119.1)
S0: custom_line_V1_comp (XP1.8), custom_line_V1_mux1 (DA3.10), custom_line_V1_mux2 (DA4.10), custom_line_V1_mux3 (DA5.10), custom_line_V1_mux4 (DA6.10), custom_line_V1_mux5 (DA7.10), custom_line_V1_mux6 (DA8.10)
S1: custom_line_V1_comp (XP1.10), custom_line_V1_mux1 (DA3.11), custom_line_V1_mux2 (DA4.11), custom_line_V1_mux3 (DA5.11), custom_line_V1_mux4 (DA6.11), custom_line_V1_mux5 (DA7.11), custom_line_V1_mux6 (DA8.11)
S2: custom_line_V1_mux1 (DA3.14), custom_line_V1_mux2 (DA4.14), custom_line_V1_mux3 (DA5.14), custom_line_V1_mux4 (DA6.14), custom_line_V1_mux5 (DA7.14), custom_line_V1_mux6 (DA8.14)
S3: custom_line_V1_comp (XP1.12), custom_line_V1_mux1 (DA3.13), custom_line_V1_mux2 (DA4.13), custom_line_V1_mux3 (DA5.13), custom_line_V1_mux4 (DA6.13), custom_line_V1_mux5 (DA7.13), custom_line_V1_mux6 (DA8.13)